# Altium schematic sheet S7CAS-PLEIADES-CARTE-MERE_P02_POWER_CARRIER.SchDoc
size Tabloid; DocumentNumber: 3; SheetNumber: 3; SheetTotal: 14; Size: 11x17; Sheet_Name: Alimentation carte-mère
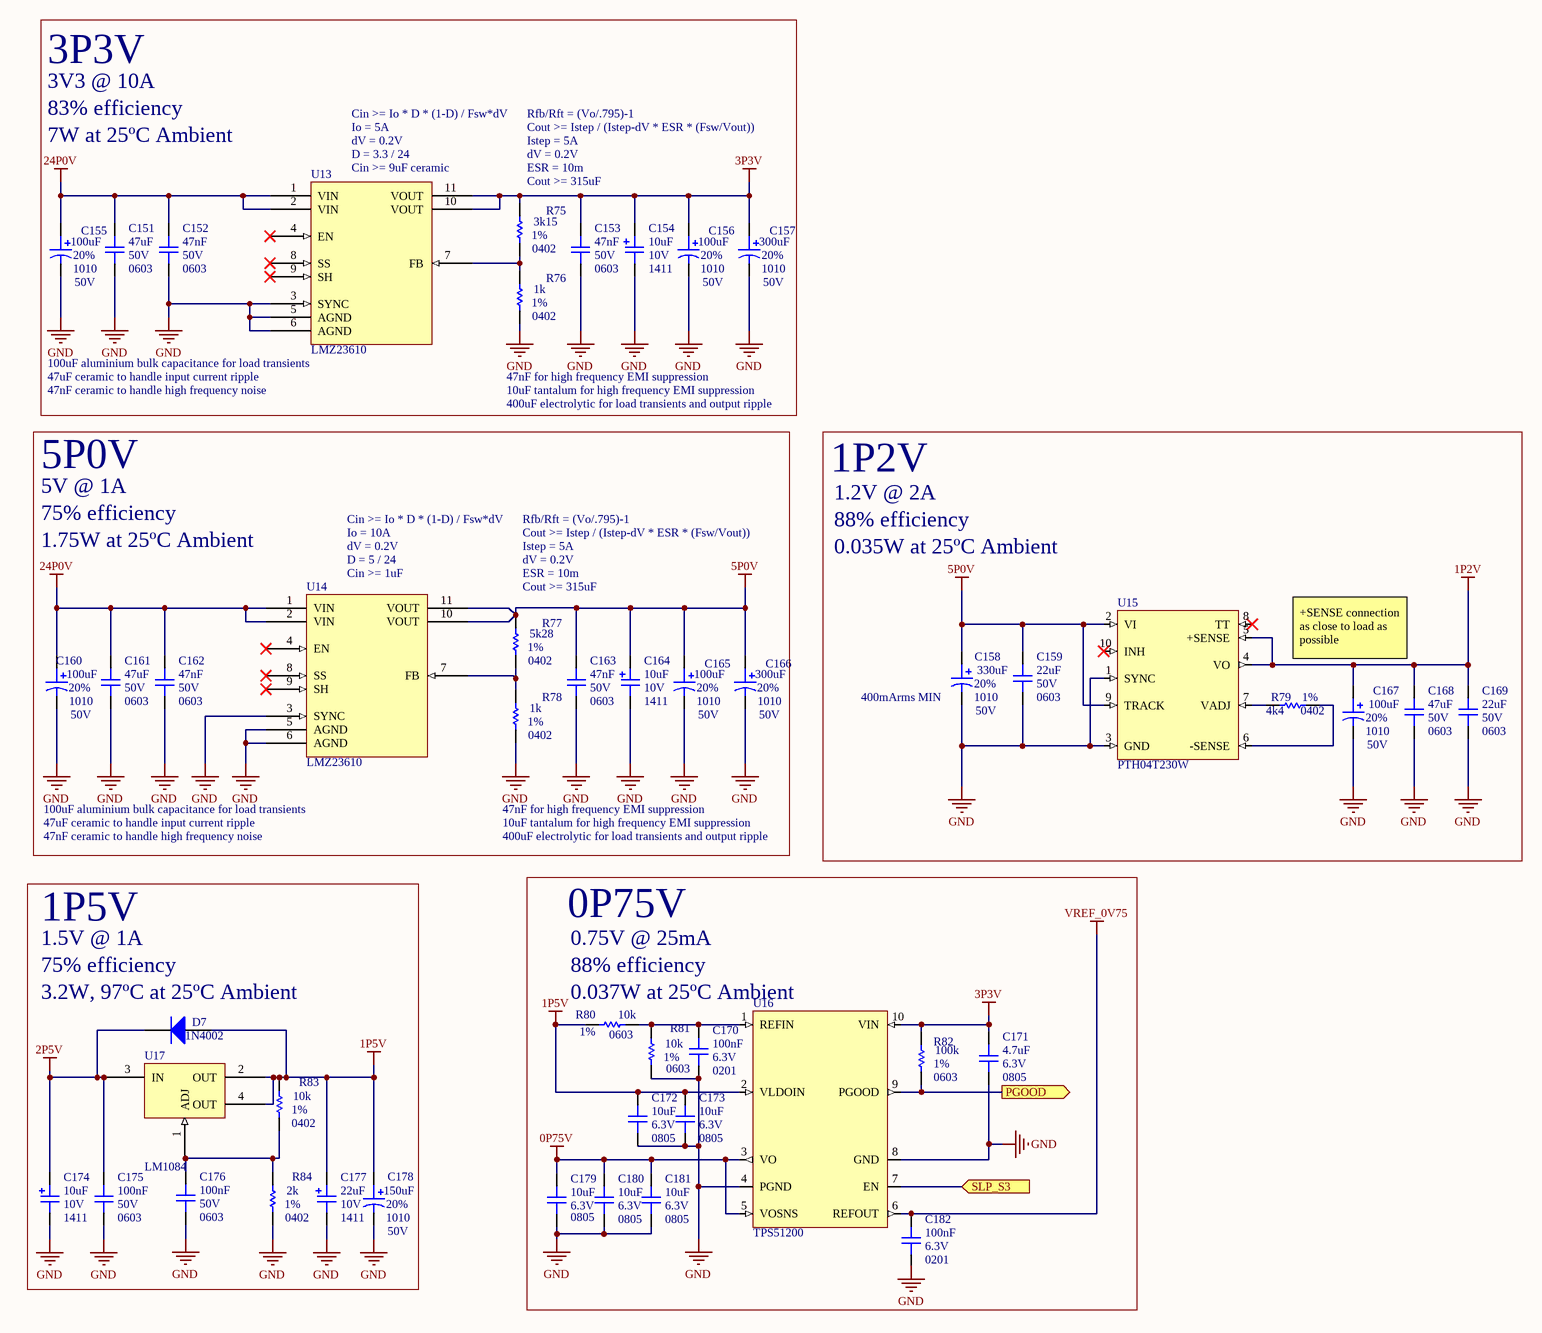
[diagram p0: S7CAS-PLEIADES-CARTE-MERE_P02_POWER_CARRIER.SchDoc]

## Parts
C151  value 47uF  Voltage: 50V  Package: 0603  [CAP_0603]  (hidden comment: CAP - 0603)
C152  value 47nF  Voltage: 50V  Package: 0603  [CAP_0603]  (hidden comment: CAP - 0603)
C153  value 47nF  Voltage: 50V  Package: 0603  [CAP_0603]  (hidden comment: CAP - 0603)
C154  value 10uF  Voltage: 10V  Package: 1411  [CAP_TAN_1411(B)]  (hidden comment: CAP - TANTALUM - CASE B)
C155  value 100uF  Voltage: 50V  Package: 1010  Precision: 20%  [CAP_ALU_1010_vishay]  (hidden comment: MAL215099101E3)
C156  value 100uF  Voltage: 50V  Package: 1010  Precision: 20%  [CAP_ALU_1010_vishay]  (hidden comment: MAL215099101E3)
C157  value 300uF  Voltage: 50V  Package: 1010  Precision: 20%  [CAP_ALU_1010_vishay]  (hidden comment: MAL215099101E3)
C158  value 330uF  Voltage: 50V  Package: 1010  Precision: 20%  [CAP_ALU_1010_vishay]  (hidden comment: MAL215099101E3)
C159  value 22uF  Voltage: 50V  Package: 0603  [CAP_0603]  (hidden comment: CAP - 0603)
C160  value 100uF  Voltage: 50V  Package: 1010  Precision: 20%  [CAP_ALU_1010_vishay]  (hidden comment: MAL215099101E3)
C161  value 47uF  Voltage: 50V  Package: 0603  [CAP_0603]  (hidden comment: CAP - 0603)
C162  value 47nF  Voltage: 50V  Package: 0603  [CAP_0603]  (hidden comment: CAP - 0603)
C163  value 47nF  Voltage: 50V  Package: 0603  [CAP_0603]  (hidden comment: CAP - 0603)
C164  value 10uF  Voltage: 10V  Package: 1411  [CAP_TAN_1411(B)]  (hidden comment: CAP - TANTALUM - CASE B)
C165  value 100uF  Voltage: 50V  Package: 1010  Precision: 20%  [CAP_ALU_1010_vishay]  (hidden comment: MAL215099101E3)
C166  value 300uF  Voltage: 50V  Package: 1010  Precision: 20%  [CAP_ALU_1010_vishay]  (hidden comment: MAL215099101E3)
C167  value 100uF  Voltage: 50V  Package: 1010  Precision: 20%  [CAP_ALU_1010_vishay]  (hidden comment: MAL215099101E3)
C168  value 47uF  Voltage: 50V  Package: 0603  [CAP_0603]  (hidden comment: CAP - 0603)
C169  value 22uF  Voltage: 50V  Package: 0603  [CAP_0603]  (hidden comment: CAP - 0603)
C170  value 100nF  Voltage: 6.3V  Package: 0201  [CAP_0201]  (hidden comment: CAP - 0201)
C171  value 4.7uF  Voltage: 6.3V  Package: 0805  [CAP_0805]  (hidden comment: CAP - 0805)
C172  value 10uF  Voltage: 6.3V  Package: 0805  [CAP_0805]  (hidden comment: CAP - 0805)
C173  value 10uF  Voltage: 6.3V  Package: 0805  [CAP_0805]  (hidden comment: CAP - 0805)
C174  value 10uF  Voltage: 10V  Package: 1411  [CAP_TAN_1411(B)]  (hidden comment: CAP - TANTALUM - CASE B)
C175  value 100nF  Voltage: 50V  Package: 0603  [CAP_0603]  (hidden comment: CAP - 0603)
C176  value 100nF  Voltage: 50V  Package: 0603  [CAP_0603]  (hidden comment: CAP - 0603)
C177  value 22uF  Voltage: 10V  Package: 1411  [CAP_TAN_1411(B)]  (hidden comment: CAP - TANTALUM - CASE B)
C178  value 150uF  Voltage: 50V  Package: 1010  Precision: 20%  [CAP_ALU_1010_vishay]  (hidden comment: MAL215099101E3)
C179  value 10uF  Voltage: 6.3V  Package: 0805  [CAP_0805]  (hidden comment: CAP - 0805)
C180  value 10uF  Voltage: 6.3V  Package: 0805  [CAP_0805]  (hidden comment: CAP - 0805)
C181  value 10uF  Voltage: 6.3V  Package: 0805  [CAP_0805]  (hidden comment: CAP - 0805)
C182  value 100nF  Voltage: 6.3V  Package: 0201  [CAP_0201]  (hidden comment: CAP - 0201)
D7  1N4002  [DO-41]
R75  value 3k15  Package: 0402  Precision: 1%  [RES_0402]  (hidden comment: RES - 0402)
R76  value 1k  Package: 0402  Precision: 1%  [RES_0402]  (hidden comment: RES - 0402)
R77  value 5k28  Package: 0402  Precision: 1%  [RES_0402]  (hidden comment: RES - 0402)
R78  value 1k  Package: 0402  Precision: 1%  [RES_0402]  (hidden comment: RES - 0402)
R79  value 4k4  Package: 0402  Precision: 1%  [RES_0402]  (hidden comment: RES - 0402)
R80  value 10k  Package: 0603  Precision: 1%  [RES_0402]  (hidden comment: RES - 0603)
R81  value 10k  Package: 0603  Precision: 1%  [RES_0402]  (hidden comment: RES - 0603)
R82  value 100k  Package: 0603  Precision: 1%  [RES_0402]  (hidden comment: RES - 0603)
R83  value 10k  Package: 0402  Precision: 1%  [RES_0402]  (hidden comment: RES - 0402)
R84  value 2k  Package: 0402  Precision: 1%  [RES_0402]  (hidden comment: RES - 0402)
U13  LMZ23610  [NDY0011A]
U14  LMZ23610  [NDY0011A]
U15  PTH04T230W  [PTH04T230W]
U16  TPS51200  [VSON-10]
U17  LM1084  [DPAK-3]

## Blocks framed on the sheet
3P3V: C151-C157 R75 R76 U13
5P0V: C160-C166 R77 R78 U14
1P2V: C158 C159 C167-C169 R79 U15
1P5V: C174-C178 D7 R83 R84 U17
0P75V: C170-C173 C179-C182 R80-R82 U16

## Ports
PGOOD (out), SLP_S3 (in)

## Nets
0P75V: C179.2 C180.2 C181.2 U16.3(VO) U16.5(VOSNS)
1P2V: C167.1 C168.2 C169.2 U15.4(VO) U15.5(+SENSE)
1P5V: C172.2 C173.2 C177.2 C178.1 D7.1(A) R80.2 R83.2 U16.2(VLDOIN) U17.2(OUT) U17.4(OUT)
2P5V: C174.2 C175.2 D7.2(K) U17.3(IN)
3P3V: C153.2 C154.2 C156.1 C157.1 C171.2 R75.2 R82.2 U13.10(VOUT) U13.11(VOUT) U16.10(VIN)
5P0V: C158.1 C159.2 C163.2 C164.2 C165.1 C166.1 R77.2 U14.10(VOUT) U14.11(VOUT) U15.2(VI) U15.9(TRACK)
24P0V: C151.2 C152.2 C155.1 C160.1 C161.2 C162.2 U13.1(VIN) U13.2(VIN) U14.1(VIN) U14.2(VIN)
GND: C151.1 C152.1 C153.1 C154.1 C155.2 C156.2 C157.2 C158.2 C159.1 C160.2 C161.1 C162.1 C163.1 C164.1 C165.2 C166.2 C167.2 C168.1 C169.1 C170.1 C171.1 C172.1 C173.1 C174.1 C175.1 C176.1 C177.1 C178.2 C179.1 C180.1 C181.1 R76.1 R78.1 R81.1 R84.1 U13.3(SYNC) U13.5(AGND) U13.6(AGND) U14.3(SYNC) U14.5(AGND) U14.6(AGND) U15.1(SYNC) U15.3(GND) U16.4(PGND) U16.8(GND)
VREF_0V75: C182.2 U16.6(REFOUT)
PGOOD: R82.1 U16.9(PGOOD) ; port PGOOD
SLP_S3: U16.7(EN) ; port SLP_S3
NetC170_2: C170.2 R80.1 R81.2 U16.1(REFIN)
NetC176_2: C176.2 R83.1 R84.2 U17.1(ADJ)
NetR75_1: R75.1 R76.2 U13.7(FB)
NetR77_1: R77.1 R78.2 U14.7(FB)
NetR79_1: R79.1 U15.6(-SENSE)
NetR79_2: R79.2 U15.7(VADJ)

Not connected (* = marked no-connect by the designer): C182 1; U13 4(EN)* 8(SS)* 9(SH)*; U14 4(EN)* 8(SS)* 9(SH)*; U15 8(TT)* 10(INH)*

## Notes on the sheet
- 3V3 @ 10A
- 83% efficiency
- Cin >= Io * D * (1-D) / Fsw*dV
- Rfb/Rft = (Vo/.795)-1
- 7W at 25ºC Ambient
- Io = 5A
- (near U13) dV = 0.2V
- (near U13) Cin >= 9uF ceramic
- (near U13) D = 3.3 / 24
- Cout >= Istep / (Istep-dV * ESR * (Fsw/Vout))
- Istep = 5A
- dV = 0.2V
- ESR = 10m
- (near R75) Cout >= 315uF
- (near U13) 47uF ceramic to handle input current ripple
- (near U13) 100uF aluminium bulk capacitance for load transients
- 47nF for high frequency EMI suppression
- 47nF ceramic to handle high frequency noise
- 10uF tantalum for high frequency EMI suppression
- 400uF electrolytic for load transients and output ripple
- 5V @ 1A
- 75% efficiency
- 1.2V @ 2A
- 1.75W at 25ºC Ambient
- Io = 10A
- (near U14) Cin >= 1uF
- (near U14) D = 5 / 24
- (near R77) ESR = 10m
- (near R77) Cout >= 315uF
- 88% efficiency
- 0.035W at 25ºC Ambient
- +SENSE connection as close to load as possible
- (near C158) 400mArms MIN
- 47uF ceramic to handle input current ripple
- 100uF aluminium bulk capacitance for load transients
- 1.5V @ 1A
- (near D7) 75% efficiency
- 0.75V @ 25mA
- (near D7) 3.2W, 97ºC at 25ºC Ambient
- 0.037W at 25ºC Ambient
- Labels drawn without touching a wire or pin: GND
- Sheet Name
- Project Title
- Global Project
- Size
- Group
- Revision
- Date
- Sheet
- of
- Filename
- Designers

## Library data of the parts
C151-C153 C159 C161-C163 C168 C169 C175 C176 = CAP - 0603: Precision: 10%; Current: *; CreatedBy: Jonathan Bouchard; Power: *
C154 C164 C174 C177 = CAP_TANT_1411(B): CAP - TANTALUM - 1411; Precision: 10%; Current: *; CreatedBy: Jonathan Bouchard; Power: *
C155-C158 C160 C165-C167 C178 = CAP_ALU_MAL215099101E3: CAP - ALU 100uF 20% 50V - 1010; Current: 490mA; Mfg: Vishay Dale; Mfg Part Number: MAL215099101E3; HelpURL: http://www.vishay.com/docs/28395/150crz.pdf; CreatedBy: Jonathan Bouchard; Temperature: -55°C to 125°C; Power: *; Supplier 1: Digikey; Supplier Part Number 1: 4399PHDKR-ND
C170 C182 = CAP - 0201: Precision: 10%; Current: *; CreatedBy: Jonathan Bouchard; Power: *
C171-C173 C179-C181 = CAP - 0805: Precision: 10%; Current: *; CreatedBy: Jonathan Bouchard; Power: *
D7 = Diode 1N4002: 1 Amp General Purpose Rectifier; Published: 8-Jun-2000; LatestRevisionDate: 17-Jul-2002; LatestRevisionNote: Re-released for DXP Platform.; DatasheetVersion: 1998; PackageVersion: Aug-1999; PackageReference: DO-41; Publisher: Altium Limited; PackageDescription: Diode, Axial; Body 5.2 x 2.7 mm (LxDia. max), Lead Dia. 0.86 mm (max); Code_JEDEC: DO-204-AL; ComponentLink1Description: Manufacturer Link; ComponentLink1URL: http://www.fairchildsemi.com/; ComponentLink2Description: Datasheet; ComponentLink2URL: http://www.fairchildsemi.com/ds/1N%2F1N4001.pdf
R75-R79 R83 R84 = RES - 0402: Voltage: 50V; Power: 1/16W; Current: *; CreatedBy: Jonathan Bouchard
U15 = PTH04T230W: XXX - Description - Package; GRAMS Lib Spec: 2.7
U16 = TPS51200: TPS51200 / Sink and Source / DDR Termination / Regulator
R80-R82 = RES - 0603: Current: *; CreatedBy: Jonathan Bouchard